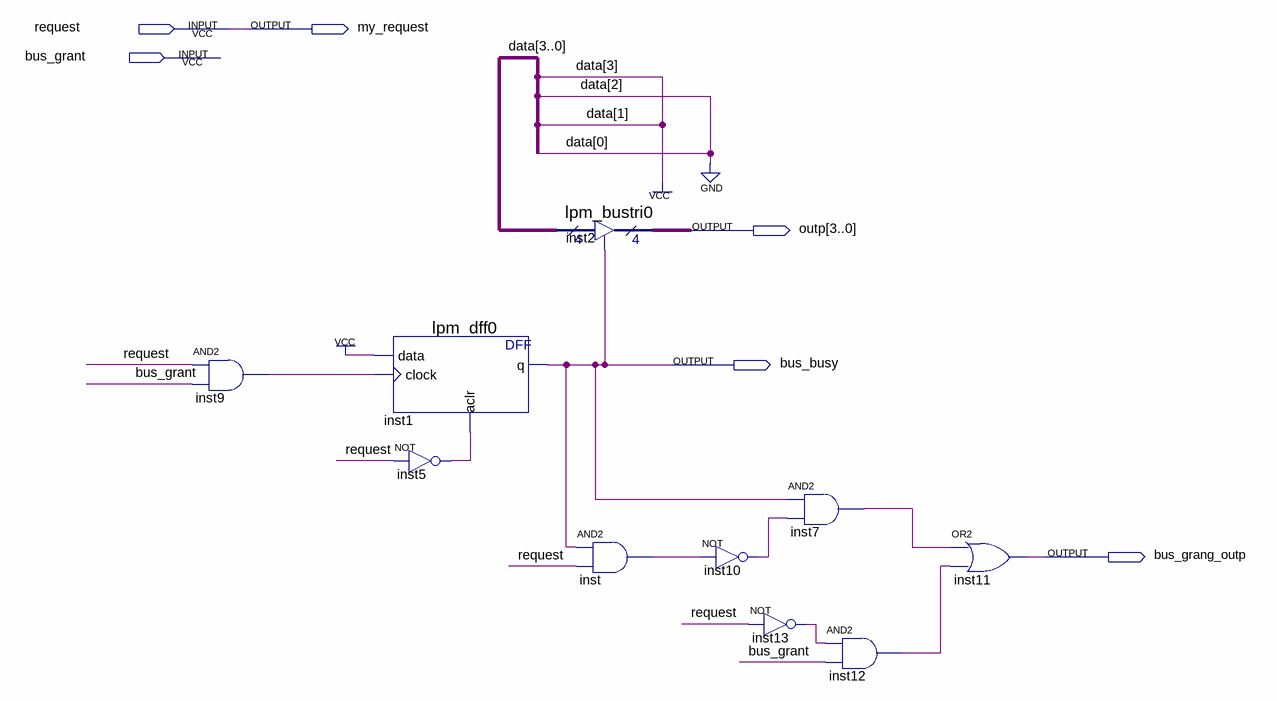
[diagram p0: schematic sheet]
// Quartus schematic device1.bdf as structural Verilog: 10 symbols, 6 pins
module device1 (
  input  request,
  input  bus_grant,
  output my_request,
  output [3:0] outp,
  output bus_busy,
  output bus_grang_outp
);

  wire inst5_out, inst7_out, inst9_out, inst10_out, inst12_out, inst13_out, inst_out;

  and inst9 (inst9_out, request, bus_grant);
  lpm_dff0 inst1 (.data(1'b1), .clock(inst9_out), .aclr(inst5_out), .q(bus_busy));
  not inst5 (inst5_out, request);
  lpm_bustri0 inst2 (.enabledt(bus_busy), .data(4'b1010), .tridata(outp));
  and inst (inst_out, bus_busy, request);
  not inst10 (inst10_out, inst_out);
  and inst7 (inst7_out, bus_busy, inst10_out);
  not inst13 (inst13_out, request);
  and inst12 (inst12_out, inst13_out, bus_grant);
  or inst11 (bus_grang_outp, inst7_out, inst12_out);

  assign my_request = request;
endmodule
